# Altium schematic sheet Overview.SchDoc
size A; SheetNumber: 1; SheetTotal: 7
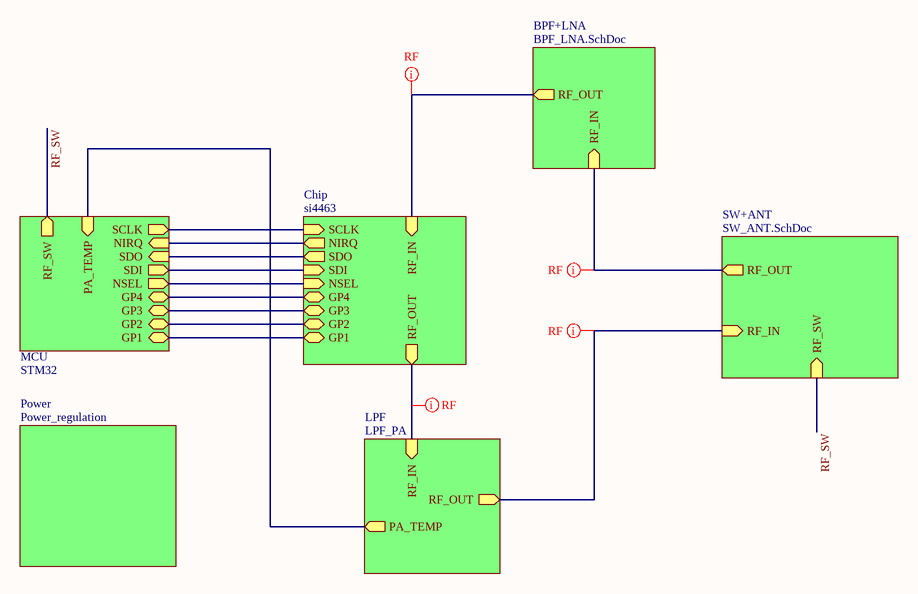
[diagram p0: Overview.SchDoc]

## Sub-sheets
BPF+LNA = BPF_LNA.SchDoc: RF_OUT (out), RF_IN (in)
Chip = si4463: SDI (in), SDO (out), NIRQ (out), SCLK (in), NSEL (in), RF_IN (in), RF_OUT (out), GP1 (bidir), GP2 (bidir), GP3 (bidir), GP4 (bidir)
LPF = LPF_PA: RF_IN (in), RF_OUT (out), PA_TEMP (out)
Power = Power_regulation: no entries
STM32 = MCU: NSEL (out), NIRQ (in), SDI (out), SDO (in), SCLK (out), RF_SW (out), GP1 (bidir), GP2 (bidir), GP3 (bidir), GP4 (bidir), PA_TEMP (in)
SW+ANT = SW_ANT.SchDoc: RF_OUT (out), RF_IN (in), RF_SW (in)

## Nets
RF_SW: sheet STM32/RF_SW, sheet SW+ANT/RF_SW
(unnamed): sheet STM32/NSEL, sheet Chip/NSEL
(unnamed): sheet STM32/NIRQ, sheet Chip/NIRQ
(unnamed): sheet STM32/SDI, sheet Chip/SDI
(unnamed): sheet STM32/SDO, sheet Chip/SDO
(unnamed): sheet STM32/SCLK, sheet Chip/SCLK
(unnamed): sheet STM32/GP1, sheet Chip/GP1
(unnamed): sheet STM32/GP2, sheet Chip/GP2
(unnamed): sheet STM32/GP3, sheet Chip/GP3
(unnamed): sheet STM32/GP4, sheet Chip/GP4
(unnamed): sheet STM32/PA_TEMP, sheet LPF/PA_TEMP
(unnamed): sheet Chip/RF_IN, sheet BPF+LNA/RF_OUT
(unnamed): sheet Chip/RF_OUT, sheet LPF/RF_IN
(unnamed): sheet LPF/RF_OUT, sheet SW+ANT/RF_IN
(unnamed): sheet BPF+LNA/RF_IN, sheet SW+ANT/RF_OUT

## Layout directives
rule Impedance Constraint [Min = 50.00    Max = 50.00    ]; net class RF: (no net found under the mark)

## Notes on the sheet
- DWG NO:
- REV:
- THIS DOCUMENT AND THE DATA DISCLOSED HEREIN OR
- HEREWITH IS THE PROPERTY OF ALTIUM LIMITED AND MAY
- BE FREELY DISTRIBUTED IN WHOLE. NO RIGHTS ARE
- RESERVED OR EXPRESS OR IMPLIED WARANTEE GIVEN.
- REVISION
- DESCRIPTION
- DATE
- APPROVED
- ENG:
- APPROVALS
- PROJECT
- DSN:
- CHK:
- REFERENCE DOCUMENTS
- PROJECT REVISION:
- TITLE
- DOCUMENT REVISION:
- DESIGN ITEM:
- BOM:
- FAB DWG:
- PCB DWG:
- ASSY DWG:
- SCALE:
- A2
- SIZE
- CAGE CODE
- FILE NAME
- DWG NO.
- SHEET
- OF
- REV